# Altium schematic sheet Nano2.SchDoc
size Letter; CompanyName: Ploopy Corporation; Organization: Ploopy Corporation; Address1: 137-1140 Burnhamthorpe Road W; Address2: Mississauga; Address3: Ontario; Address4: Canada L5C 0A3; DocumentNumber: 1; Revision: R2.003; SheetNumber: 1; SheetTotal: 8
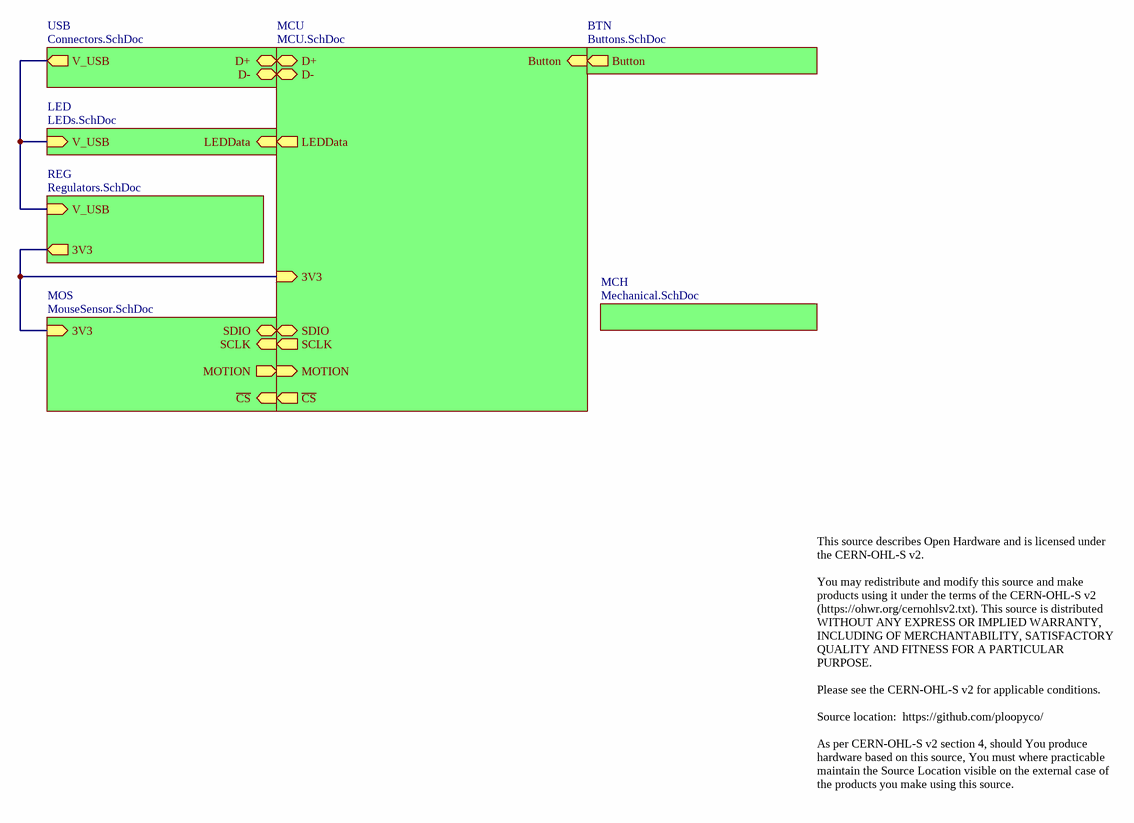
[diagram p0: Nano2.SchDoc]

## Sub-sheets
BTN = Buttons.SchDoc: Button (out)
LED = LEDs.SchDoc: V_USB (in), LEDData (in)
MCH = Mechanical.SchDoc: no entries
MCU = MCU.SchDoc: D+ (bidir), D- (bidir), Button (in), LEDData (out), 3V3 (in), SDIO (bidir), SCLK (out), ~{CS} (out), MOTION (in)
MOS = MouseSensor.SchDoc: 3V3 (in), ~{CS} (in), SDIO (bidir), SCLK (in), MOTION (out)
REG = Regulators.SchDoc: 3V3 (out), V_USB (in)
USB = Connectors.SchDoc: D+ (bidir), V_USB (out), D- (bidir)

## Nets
(unnamed): sheet USB/D+, sheet MCU/D+
(unnamed): sheet USB/V_USB, sheet LED/V_USB, sheet REG/V_USB
(unnamed): sheet USB/D-, sheet MCU/D-
(unnamed): sheet LED/LEDData, sheet MCU/LEDData
(unnamed): sheet REG/3V3, sheet MOS/3V3, sheet MCU/3V3
(unnamed): sheet MOS/~{CS}, sheet MCU/~{CS}
(unnamed): sheet MOS/SDIO, sheet MCU/SDIO
(unnamed): sheet MOS/SCLK, sheet MCU/SCLK
(unnamed): sheet MOS/MOTION, sheet MCU/MOTION
(unnamed): sheet MCU/Button, sheet BTN/Button

## Notes on the sheet
- This source describes Open Hardware and is licensed under the CERN-OHL-S v2.
  You may redistribute and modify this source and make products using it under the terms of the CERN-OHL-S v2 (https://ohwr.org/cernohlsv2.txt). This source is distributed WITHOUT ANY EXPRESS OR IMPLIED WARRANTY, INCLUDING OF MERCHANTABILITY, SATISFACTORY QUALITY AND FITNESS FOR A PARTICULAR PURPOSE.
  Please see the CERN-OHL-S v2 for applicable conditions.
  Source location:  https://github.com/ploopyco/
  As per CERN-OHL-S v2 section 4, should You produce hardware based on this source, You must where practicable maintain the Source Location visible on the external case of the products you make using this source.
- Copyright Ploopy Corporation 2024
- Licensed under the CERN-OHL-S v2
- http://ohwr.org/cernohl
- Title:
- PCB:
- Version:
- Ploopy Corporation
- Mississauga ON L5C 0A3
- 137-1140 Burnhamthorpe Road W
- Date:
- Time:
- Sheet
- of
- Canada